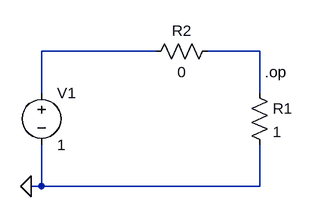
[diagram p0: schematic VSource_series2R_0Value.asc]
VSource_series2R_0Value.asc, the LTspice schematic file:
Version 4
SHEET 1 880 680
WIRE 288 240 112 240
WIRE 448 240 368 240
WIRE 112 304 112 240
WIRE 448 304 448 240
WIRE 112 448 112 384
WIRE 112 448 96 448
WIRE 448 448 448 384
WIRE 448 448 112 448
FLAG 96 448 0
SYMBOL voltage 112 288 R0
SYMATTR InstName V1
SYMATTR Value 1
SYMBOL res 432 288 R0
SYMATTR InstName R1
SYMATTR Value 1
SYMBOL res 384 224 R90
WINDOW 0 0 56 VBottom 2
WINDOW 3 32 56 VTop 2
SYMATTR InstName R2
SYMATTR Value 0
TEXT 456 272 Left 2 !.op

The netlist it stands for:
* VSource_series2R_0Value.asc
V1 N001 0 1
R1 N002 0 1
R2 N002 N001 0
.op
.backanno
.end